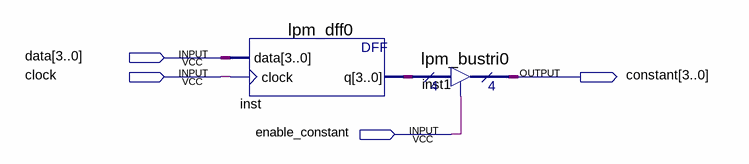
[diagram p0: schematic sheet]
// Quartus schematic ConstantRegister.bdf as structural Verilog: 2 symbols, 4 pins
module ConstantRegister (
  input  [3:0] data,
  input  clock,
  input  enable_constant,
  output [3:0] constant
);

  wire [3:0] inst_q;

  lpm_dff0 inst (.data(data), .clock(clock), .q(inst_q));
  lpm_bustri0 inst1 (.enabledt(enable_constant), .data(inst_q), .tridata(constant));
endmodule
